# EAGLE design ido (EAGLE 7.6.0)
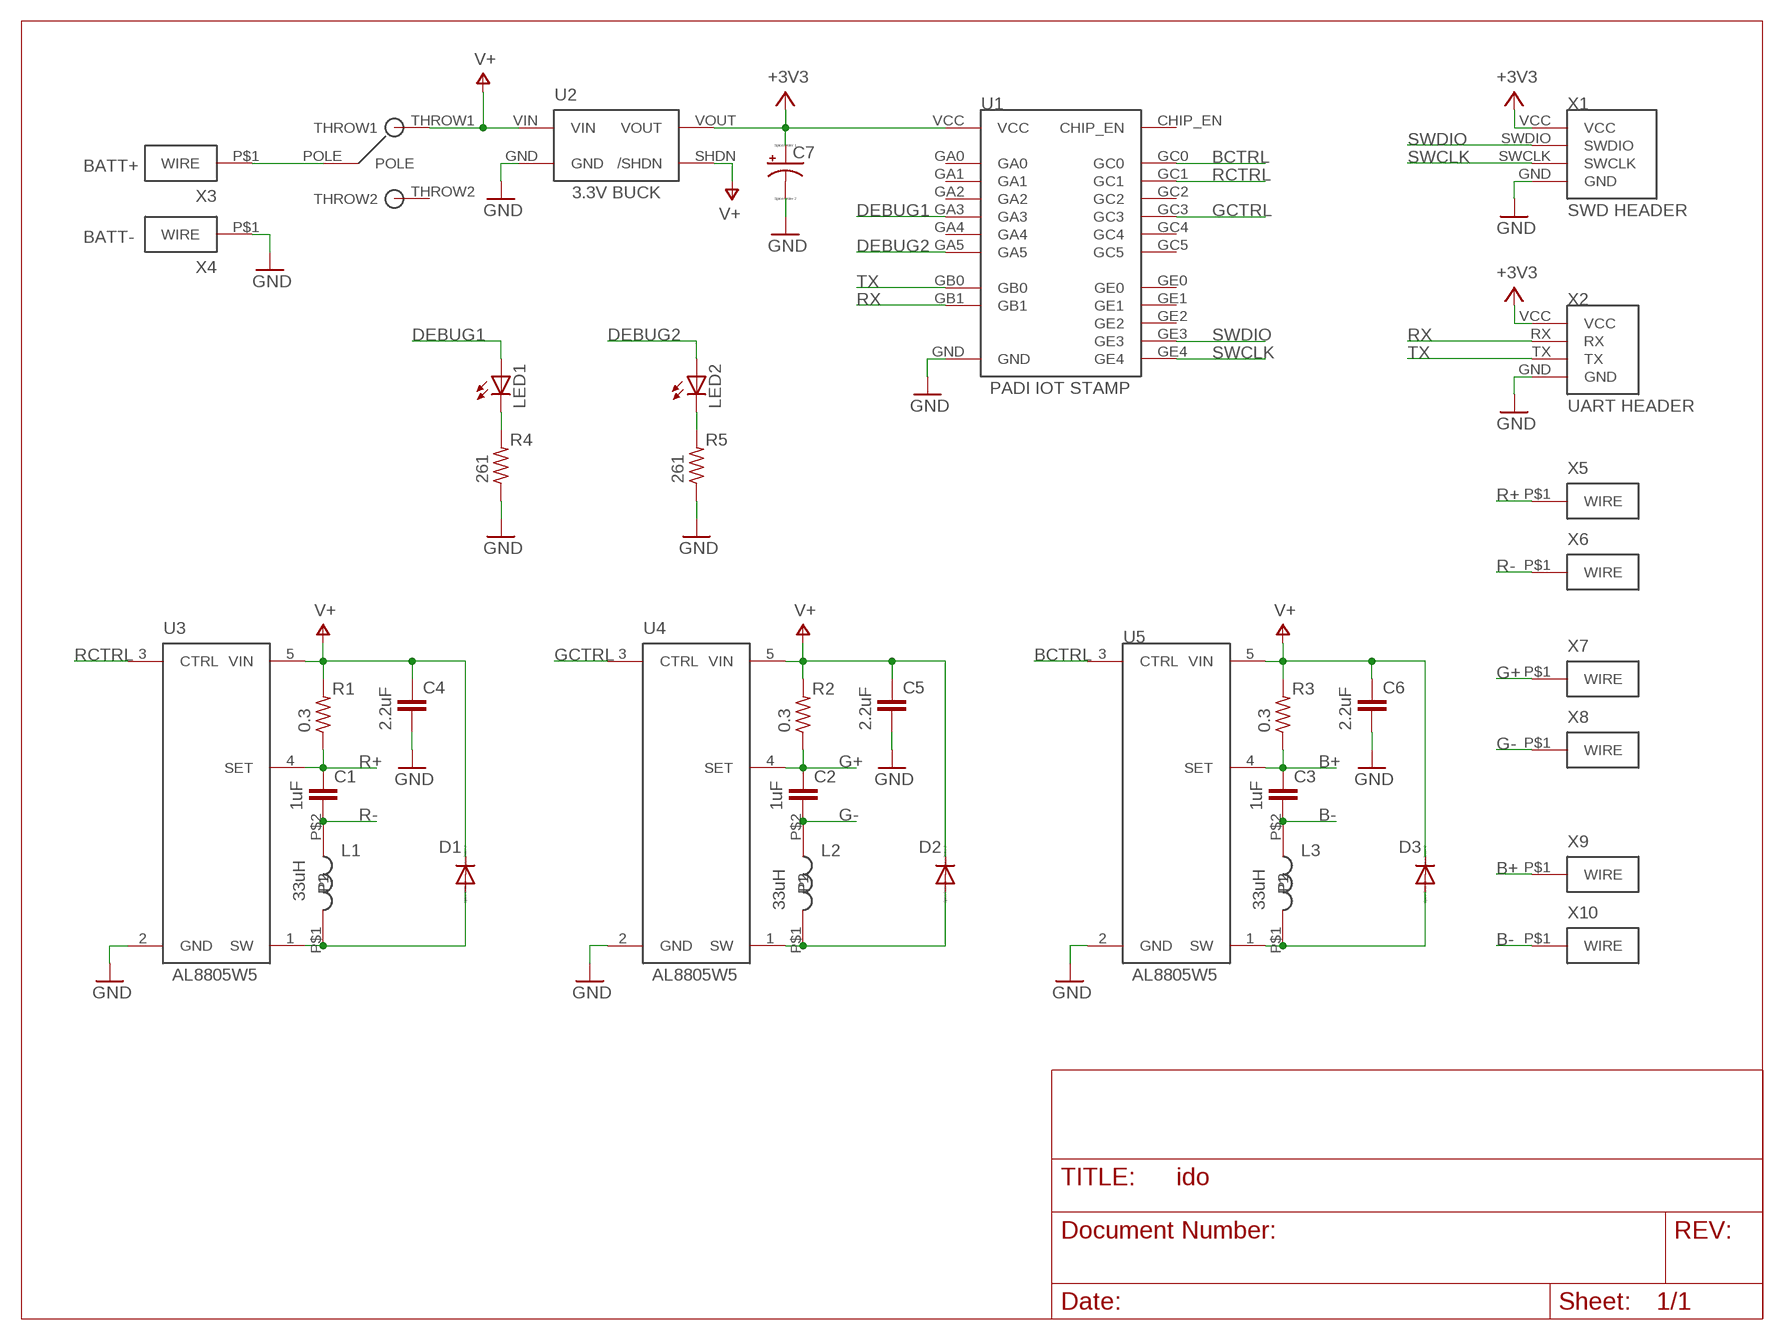
[diagram p0: schematic, sheet 1]

## Parts
C1  1uF  C-EUC0603  [C0603]
C2  1uF  C-EUC0603  [C0603]
C3  1uF  C-EUC0603  [C0603]
C4  2.2uF  C-EUC0603  [C0603]
C5  2.2uF  C-EUC0603  [C0603]
C6  2.2uF  C-EUC0603  [C0603]
C7  CPOL-USE2.5-7  [E2,5-7]
D1  DIODE-DO214AC  [DO214AC]
D2  DIODE-DO214AC  [DO214AC]
D3  DIODE-DO214AC  [DO214AC]
L1  33uH  MURATA-INDUCTOR  [MURATA-INDUCTOR]
L2  33uH  MURATA-INDUCTOR  [MURATA-INDUCTOR]
L3  33uH  MURATA-INDUCTOR  [MURATA-INDUCTOR]
LED1  LEDCHIPLED_0603  [CHIPLED_0603]
LED2  LEDCHIPLED_0603  [CHIPLED_0603]
R1  0.3  R-US_R0603  [R0603]
R2  0.3  R-US_R0603  [R0603]
R3  0.3  R-US_R0603  [R0603]
R4  261  R-US_R0603  [R0603]
R5  261  R-US_R0603  [R0603]
S1  SLIDE-SWITCH  [SLIDE-SWITCH]
U1  PADI-IOT-STAMP  [PADI-IOT-STAMP]
U2  POLOLU-BUCK  [POLOLU-BUCK]
U3  AL8805W5  [SOT25]
U4  AL8805W5  [SOT25]
U5  AL8805W5  [SOT25]
X1  PROGRAMMING-HEADER  [PROGRAMMING-HEADER]
X2  UART-HEADER  [UART-HEADER]
X3  WIRE-HOLE  [WIRE-HOLE]
X4  WIRE-HOLE  [WIRE-HOLE]
X5  WIRE-HOLE  [WIRE-HOLE]
X6  WIRE-HOLE  [WIRE-HOLE]
X7  WIRE-HOLE  [WIRE-HOLE]
X8  WIRE-HOLE  [WIRE-HOLE]
X9  WIRE-HOLE  [WIRE-HOLE]
X10  WIRE-HOLE  [WIRE-HOLE]

## Nets
+3V3: C7.+ U1.VCC U2.VOUT X1.VCC X2.VCC
B+: C3.1 R3.1 U5.4(SET) X9.P$1(WIRE)
B-: C3.2 L3.P$2(P2) X10.P$1(WIRE)
BCTRL: U1.GC0 U5.3(CTRL)
DEBUG1: LED1.A U1.GA3
DEBUG2: LED2.A U1.GA5
G+: C2.1 R2.1 U4.4(SET) X7.P$1(WIRE)
G-: C2.2 L2.P$2(P2) X8.P$1(WIRE)
GCTRL: U1.GC3 U4.3(CTRL)
GND: C4.2 C5.2 C6.2 C7.- R4.1 R5.1 U1.GND U2.GND U3.2(GND) U4.2(GND) U5.2(GND) X1.GND X2.GND X4.P$1(WIRE)
N$1: S1.POLE X3.P$1(WIRE)
N$3: LED2.C R5.2
N$4: D1.A L1.P$1(P1) U3.1(SW)
N$5: LED1.C R4.2
N$6: D2.A L2.P$1(P1) U4.1(SW)
N$9: D3.A L3.P$1(P1) U5.1(SW)
R+: C1.1 R1.1 U3.4(SET) X5.P$1(WIRE)
R-: C1.2 L1.P$2(P2) X6.P$1(WIRE)
RCTRL: U1.GC1 U3.3(CTRL)
RX: U1.GB1 X2.RX
SWCLK: U1.GE4 X1.SWCLK
SWDIO: U1.GE3 X1.SWDIO
TX: U1.GB0 X2.TX
V+: C4.1 C5.1 C6.1 D1.C D2.C D3.C R1.2 R2.2 R3.2 S1.THROW1 U2.SHDN(/SHDN) U2.VIN U3.5(VIN) U4.5(VIN) U5.5(VIN)
Unconnected: S1.THROW2 U1.CHIP_EN U1.GA0 U1.GA1 U1.GA2 U1.GA4 U1.GC2 U1.GC4 U1.GC5 U1.GE0 U1.GE1 U1.GE2

## Notes on the sheet
- BATT+
- BATT-

## Library data of the parts
C1-C6 = resistor:C-EU: CAPACITOR, European symbol
C7 = resistor:CPOL-US: POLARIZED CAPACITOR, American symbol
D1-D3 = diode:DIODE-: DIODE
L1-L3 = ido:MURATA-INDUCTOR
LED1 LED2 = led:LED: LED OSRAM: - CHIPLED LG R971, LG N971, LY N971, LG Q971, LY Q971, LO R971, LY R971 LH N974, LH R974 LS Q976, LO Q976, LY Q976 LO Q996 - Hyper CHIPLED LW Q18S LB Q993, LB Q99A, LB R99A - SideLED LS A670, LO A670, LY A670, LG A670, LP A670 LB A673, LV A673, LT A673, LW A673 LH A674 LY A675 LS A676, LA A676, LO A676, LY A676, LW A676 LS A679, LY A679, LG A679 - Hyper Micro SIDELED® LS Y876, LA Y876, LO Y876, LY Y876 LT Y87S - SmartLED LW L88C, LW L88S LB L89C, LB L89S, LG L890 LS L89K, LO L89K, LY L89K LS L896, LA L896, LO L896, LY L896 - TOPLED LS T670, LO T670, LY T670, LG T670, LP T670 LSG T670, LSP T670, LSY T670, LOP T670, LYG T670 LG T671, LOG T671, LSG T671 LB T673, LV T673, LT T673, LW T673 LH T674 LS T676, LA T676, LO T676, LY T676, LB T676, LH T676, LSB T676, LW T676 LB T67C, LV T67C, LT T67C, LS T67K, LO T67K, LY T67K, LW E67C LS E67B, LA E67B, LO E67B, LY E67B, LB E67C, LV E67C, LT E67C LW T67C LS T679, LY T679, LG T679 LS T770, LO T770, LY T770, LG T770, LP T770 LB T773, LV T773, LT T773, LW T773 LH T774 LS E675, LA E675, LY E675, LS T675 LS T776, LA T776, LO T776, LY T776, LB T776 LHGB T686 LT T68C, LB T68C - Hyper Mini TOPLED® LB M676 - Mini TOPLED Santana® LG M470 LS M47K, LO M47K, LY M47K Source: http://www.osram.convergy.de LUXEON: - LUMILED® LXK2-PW12-R00, LXK2-PW12-S00, LXK2-PW14-U00, LXK2-PW14-V00 LXK2-PM12-R00, LXK2-PM12-S00, LXK2-PM14-U00 LXK2-PE12-Q00, LXK2-PE12-R00, LXK2-PE12-S00, LXK2-PE14-T00, LXK2-PE14-U00 LXK2-PB12-K00, LXK2-PB12-L00, LXK2-PB12-M00, LXK2-PB14-N00, LXK2-PB14-P00, LXK2-PB14-Q00 LXK2-PR12-L00, LXK2-PR12-M00, LXK2-PR14-Q00, LXK2-PR14-R00 LXK2-PD12-Q00, LXK2-PD12-R00, LXK2-PD12-S00 LXK2-PH12-R00, LXK2-PH12-S00 LXK2-PL12-P00, LXK2-PL12-Q00, LXK2-PL12-R00 Source: www.luxeon.com KINGBRIGHT: KA-3528ASYC Source: www.kingbright.com
R1-R5 = resistor:R-US_: RESISTOR, American symbol
S1 = ido:SLIDE-SWITCH
U1 = ido:PADI-IOT-STAMP
U2 = ido:POLOLU-BUCK
U3-U5 = ido:AL8805W5
X1 = ido:PROGRAMMING-HEADER
X2 = ido:UART-HEADER
X3-X10 = ido:WIRE-HOLE

## Board
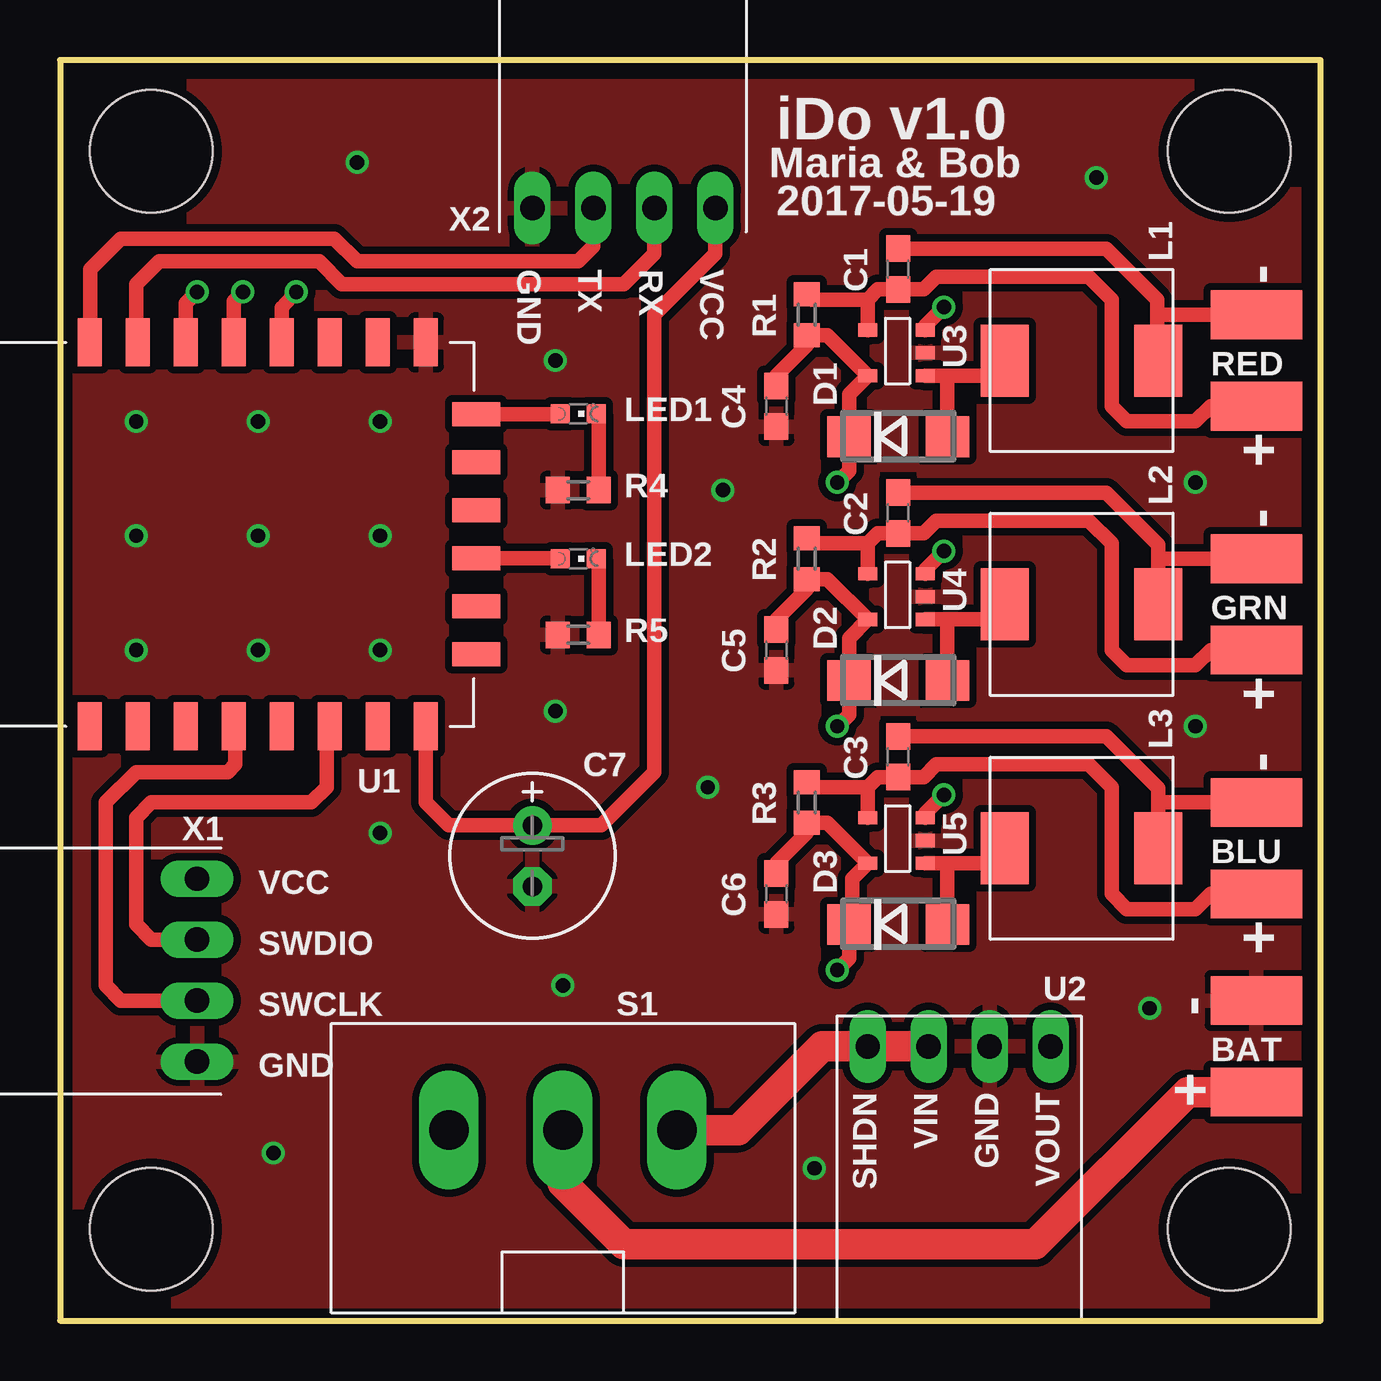
[diagram p1: board, top side]
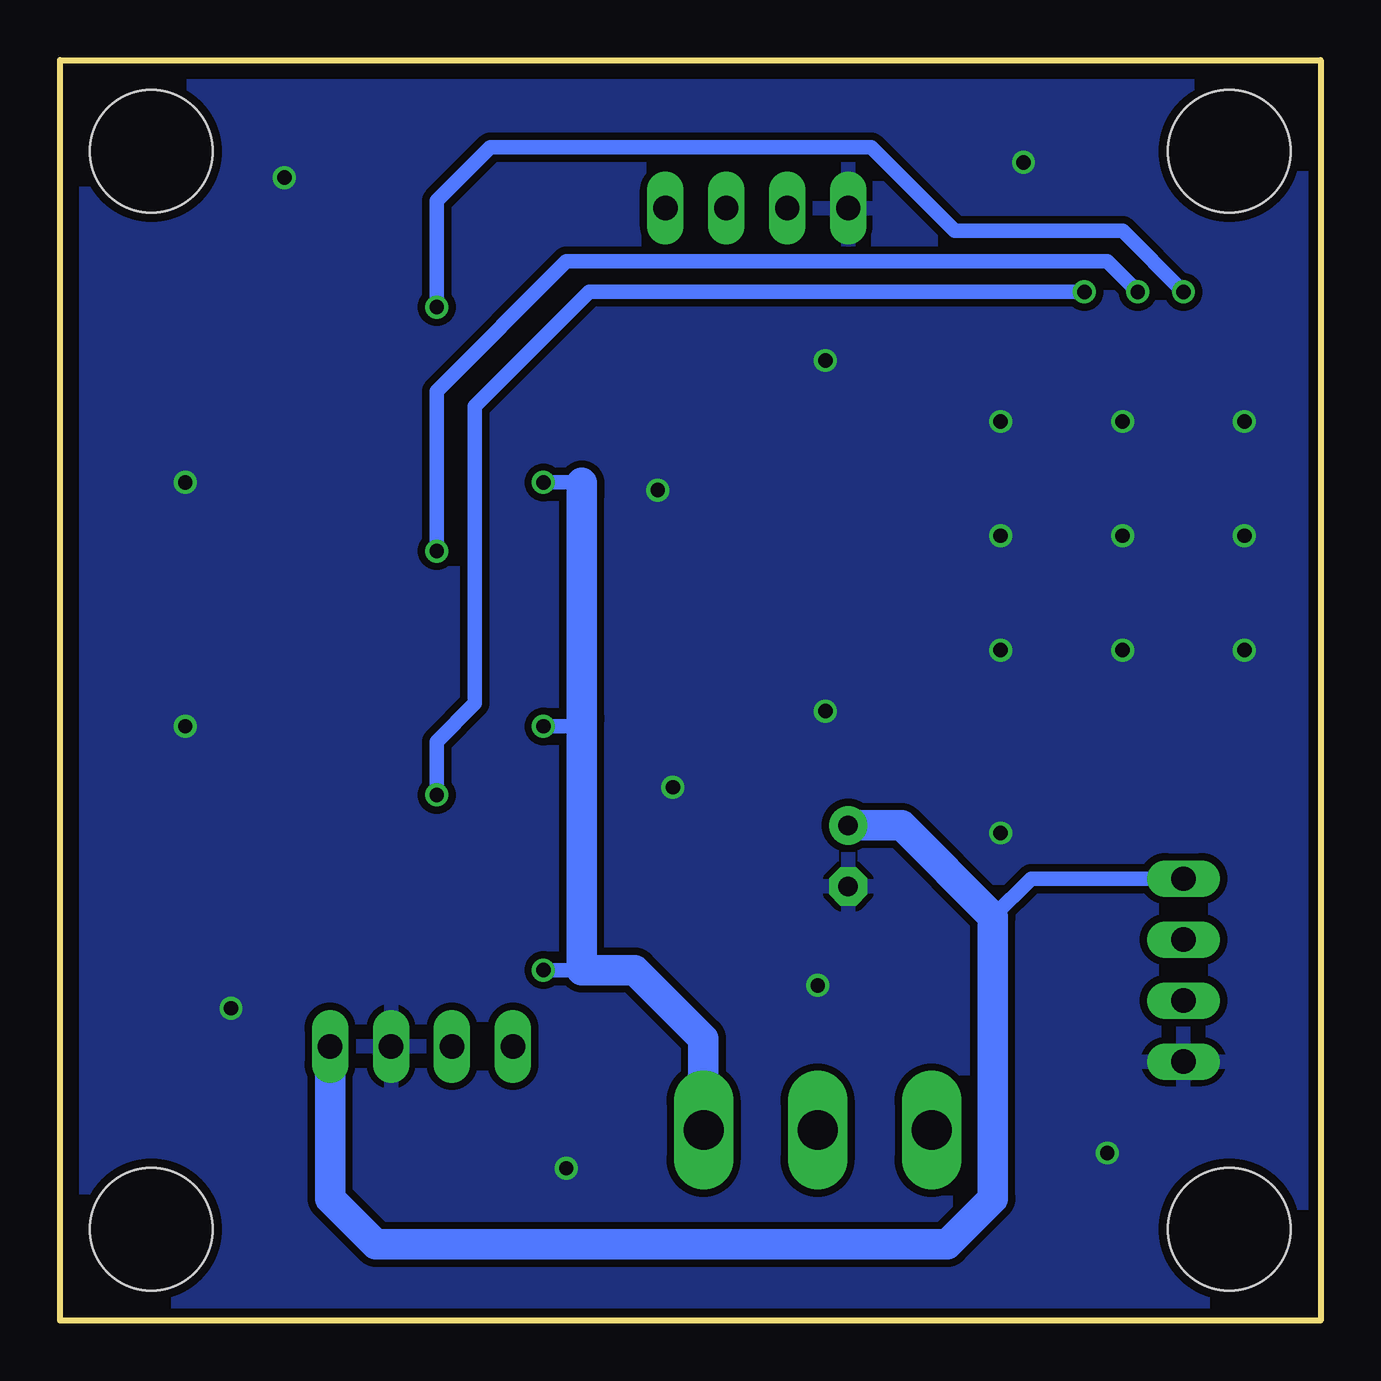
[diagram p2: board, bottom side, seen from below]

Size 52.53 x 52.53 mm. Coordinates in mm from the lower left corner, seen from the top.
Outline: 0,0 52.53,0 52.53,52.53 0,52.53 0,0
Copper layers (1*16): Top 0.0356mm / dielectric 1.5011mm / Bottom 0.0356mm
Design rules "oshpark-2layer": minimum track width 6mil, minimum drill 13mil, track to track 6mil, track to pad 6mil, pad to pad 6mil, via to via 6mil, smd to smd 6mil, copper to edge 15mil, drill to drill 6mil, minimum pad ring 7mil, minimum via ring 7mil, stop-mask expansion 2.5mil, vias tented up to drill 0mil, thermal gap 10mil
Holes 5.11 mm at 3.81,3.81 3.81,48.72 48.72,48.72 48.72,3.81

### Footprints (pad centres in the part's own frame; a part is rotated, then mirrored left to right if it is on the bottom)
C0603 = smd 1.1 x 1: 1 -0.85,0; 2 0.85,0
E2,5-7 = drill 0.813 pad 1.6: + -1.27,0 | drill 0.813 pad 1.6 octagon: - 1.27,0
DO214AC = smd 1.8 x 1.7: A 2.05,0; C -2.05,0
MURATA-INDUCTOR = smd 2 x 3: P$1 0,0; P$2 6.4,0
CHIPLED_0603 = smd 0.8 x 0.8: A 0,-0.75; C 0,0.75
R0603 = smd 1 x 1.1: 1 -0.85,0; 2 0.85,0
SLIDE-SWITCH = drill 1.651 long: POLE 0,0; THROW1 -4.75,0; THROW2 4.75,0
PADI-IOT-STAMP = smd 2 x 1: CHIP_EN 0,10; GA4 16,4; GB0 16,14; GB1 16,12; GC0 16,6; GC1 16,10; GC2 0,14; GC3 16,8; GC5 0,12; GE0 16,2; GE1 0,6; GE2 0,2; GE3 0,4; GE4 0,8; GND 16,0; VCC 0,0 | smd 1 x 2: GA0 11,-2.1; GA1 9,-2.1; GA2 3,-2.1; GA3 13,-2.1; GA5 7,-2.1; GC4 5,-2.1
POLOLU-BUCK = drill 1.016 long: GND 2.54,0; SHDN 7.62,0; VIN 5.08,0; VOUT 0,0
SOT25 = smd 0.55 x 0.8: 1 1.9,2.4; 2 0.95,2.4; 3 0,2.4; 4 0,0; 5 1.9,0
PROGRAMMING-HEADER = drill 1.016 long: GND 0,0; SWCLK 2.54,0; SWDIO 5.08,0; VCC 7.62,0
UART-HEADER = drill 1.016 long: GND 0,0; RX 5.08,0; TX 2.54,0; VCC 7.62,0
WIRE-HOLE = smd 2.032 x 3.81: P$1 0,0

### Placement (x,y rotation side)
C1  34.92,43.81 90 top
C2  34.92,33.66 90 top
C3  34.92,23.5 90 top
C4  29.84,38.1 270 top
C5  29.84,27.94 270 top
C6  29.84,17.78 270 top
C7  19.68,19.37 270 top
D1  34.92,36.83 0 top
D2  34.92,26.67 0 top
D3  34.92,16.51 0 top
L1  39.37,40.01 0 top
L2  39.37,29.84 0 top
L3  39.37,19.68 0 top
LED1  21.59,37.78 270 top
LED2  21.59,31.75 270 top
R1  31.11,41.91 270 top
R2  31.11,31.75 270 top
R3  31.11,21.59 270 top
R4  21.59,34.61 0 top
R5  21.59,28.57 0 top
S1  20.95,7.94 180 top
U1  15.24,24.77 90 top
U2  41.27,11.43 180 top
U3  33.66,41.27 270 top
U4  33.66,31.11 270 top
U5  33.66,20.95 270 top
X1  5.71,10.79 90 top
X2  19.68,46.35 0 top
X3  49.85,9.53 90 top
X4  49.85,13.34 90 top
X5  49.85,38.1 90 top
X6  49.85,41.91 90 top
X7  49.85,27.94 90 top
X8  49.85,31.75 90 top
X9  49.85,17.78 90 top
X10  49.85,21.59 90 top

### Tracks (layer width: path | path; a pad name or v marks a point on that pad's centre or on a via)
+3V3
  Top 0.61: X2.VCC 27.3,44.45 24.77,41.91 24.77,22.86 22.54,20.64 C7.+ 16.19,20.64 15.24,21.59 U1.VCC
  Bottom 0.61: X1.VCC 12.06,18.41 13.65,16.83
  Bottom 1.27: U2.VOUT 41.27,5.08 39.37,3.17 15.56,3.17 13.65,5.08 13.65,16.83 17.46,20.64 C7.+
B+
  Top 0.61: 33.66,22.23 34.08,22.64 C3.1 35.98,22.64 36.51,23.18 42.86,23.18 43.81,22.23 43.81,17.78 44.45,17.14 47.31,17.14 47.94,17.78 X9.P$1 | 33.66,22.23 31.33,22.23 R3.1 | U5.4 33.66,22.23
B-
  Top 0.61: C3.2 43.6,24.34 45.77,22.18 45.77,21.59 | L3.P$2 45.77,21.59 | X10.P$1 45.77,21.59
BCTRL  (via drill 0.6)
  Top 0.61: 9.21,40.73 U1.GC0 9.24,42.2 v9.84,42.86 | U5.3 36.05,21.13 v36.83,21.91
  Bottom 0.61: v9.84,42.86 30.48,42.86 35.24,38.1 35.24,25.72 36.83,24.13 v36.83,21.91
DEBUG1
  Top 0.61: U1.GA3 20.82,37.77 LED1.A
DEBUG2
  Top 0.61: U1.GA5 20.82,31.77 LED2.A
G+
  Top 0.61: 33.66,32.38 34.08,32.8 C2.1 35.98,32.8 36.51,33.34 42.86,33.34 43.81,32.38 43.81,27.94 44.45,27.3 47.31,27.3 47.94,27.94 X7.P$1 | 33.66,32.38 31.33,32.38 R2.1 | 33.66,32.38 U4.4
G-
  Top 0.61: C2.2 43.6,34.51 45.77,32.34 45.77,31.75 | L2.P$2 45.77,31.75 | X8.P$1 45.77,31.75
GCTRL  (via drill 0.6)
  Top 0.61: U1.GC3 7.24,42.48 v7.62,42.86 | U4.3 36.05,31.29 v36.83,32.07
  Bottom 0.61: v7.62,42.86 8.89,44.13 31.43,44.13 36.83,38.73 v36.83,32.07
GND  (via drill 0.6)
  other vias: 3.17,37.47 13.34,37.47 13.34,27.94 8.26,27.94 3.17,27.94 3.17,32.7 8.26,32.7 8.26,37.47 13.34,32.7 13.34,20.32 20.95,13.97 8.89,6.99 31.43,6.35 45.4,13.02 47.31,24.77 47.31,34.92 26.99,22.23 20.64,25.4 27.62,34.61 43.18,47.62 12.38,48.26 20.64,40.01
  pour Bottom (isolate 0.305): 0.64,51.44 51.44,51.44 51.44,0.64 0.64,0.64
  pour Top (isolate 0.305): 0.64,51.44 51.44,51.44 51.44,43.81 51.44,0.64 0.64,0.64
N$1
  Top 1.27: X3.P$1 46.99,9.53 40.64,3.17 23.5,3.17 20.95,5.71 S1.POLE
N$3
  Top 0.61: R5.2 22.44,31.65 LED2.C
N$4
  Top 0.61: U3.1 36.83,39.38 | 36.83,39.38 38.74,39.38 L1.P$1 | D1.A 36.98,39.23 36.83,39.38
N$5
  Top 0.61: R4.2 22.44,37.68 LED1.C
N$6
  Top 0.61: U4.1 36.83,29.21 | 36.83,29.21 38.74,29.21 L2.P$1 | D2.A 36.98,29.07 36.83,29.21
N$9
  Top 0.61: L3.P$1 38.74,19.05 36.83,19.05 | 36.83,19.05 U5.1 | D3.A 36.98,18.91 36.83,19.05
R+
  Top 0.61: 33.66,42.55 34.08,42.97 C1.1 35.98,42.97 36.51,43.5 42.86,43.5 43.81,42.55 43.81,38.1 44.45,37.47 47.31,37.47 47.94,38.1 X5.P$1 | 33.66,42.55 31.33,42.55 R1.1 | U3.4 33.66,42.55
R-
  Top 0.61: C1.2 43.6,44.66 45.72,42.55 45.72,41.91 | 45.72,41.91 45.72,40.05 L1.P$2 | X6.P$1 45.72,41.91
RCTRL  (via drill 0.6)
  Top 0.61: U1.GC1 5.24,42.39 v5.71,42.86 | U3.3 36.05,41.45 v36.83,42.23
  Bottom 0.61: v5.71,42.86 8.26,45.4 15.24,45.4 18.73,48.9 34.61,48.9 36.83,46.67 v36.83,42.23
RX
  Top 0.61: X2.RX 24.77,44.45 23.5,43.18 11.75,43.18 10.79,44.13 4.13,44.13 3.17,43.18 3.17,40.83 U1.GB1
SWCLK
  Top 0.61: U1.GE4 7.3,24.7 7.3,23.18 6.99,22.86 3.17,22.86 1.91,21.59 1.91,13.97 2.54,13.34 X1.SWCLK
SWDIO
  Top 0.61: U1.GE3 11.11,24.64 11.11,22.23 10.48,21.59 3.81,21.59 3.17,20.95 3.17,16.51 3.81,15.88 X1.SWDIO
TX
  Top 0.61: X2.TX 22.23,44.77 21.59,44.13 12.38,44.13 11.43,45.09 2.54,45.09 1.27,43.81 1.27,40.8 U1.GB0
V+  (via drill 0.6)
  Top 0.61: C6.1 29.84,19.05 31.11,20.32 R3.2 31.97,20.74 U5.5 33.02,18.41 33.02,17.29 D3.C 32.88,15.1 v32.38,14.61 | C5.1 29.84,29.21 31.11,30.48 R2.2 31.97,30.9 U4.5 32.88,28.43 D2.C 32.88,25.25 v32.38,24.77 | C4.1 29.84,39.37 31.11,40.64 R1.2 31.97,41.06 U3.5 32.88,38.59 D1.C 32.88,35.41 v32.38,34.92
  Top 1.27: U2.VIN U2.SHDN 31.75,11.43 28.26,7.94 S1.THROW1
  Bottom 0.61: v32.38,14.61 30.79,14.61 | 30.79,25.09 31.11,24.77 v32.38,24.77 | v32.38,34.92 30.8,34.92 30.79,34.91
  Bottom 1.27: 30.8,34.29 30.79,34.91 30.79,25.09 30.79,14.61 28.57,14.61 25.72,11.75 25.72,7.95 S1.THROW1

### Text on the board
tPlace: iDo v1.0 | Maria & Bob | 2017-05-19 | - | RED | + | - | GRN | + | - | BLU | + | - | BAT | +